# EAGLE design TeensyBufferWithNetworks (EAGLE 6.6.0)
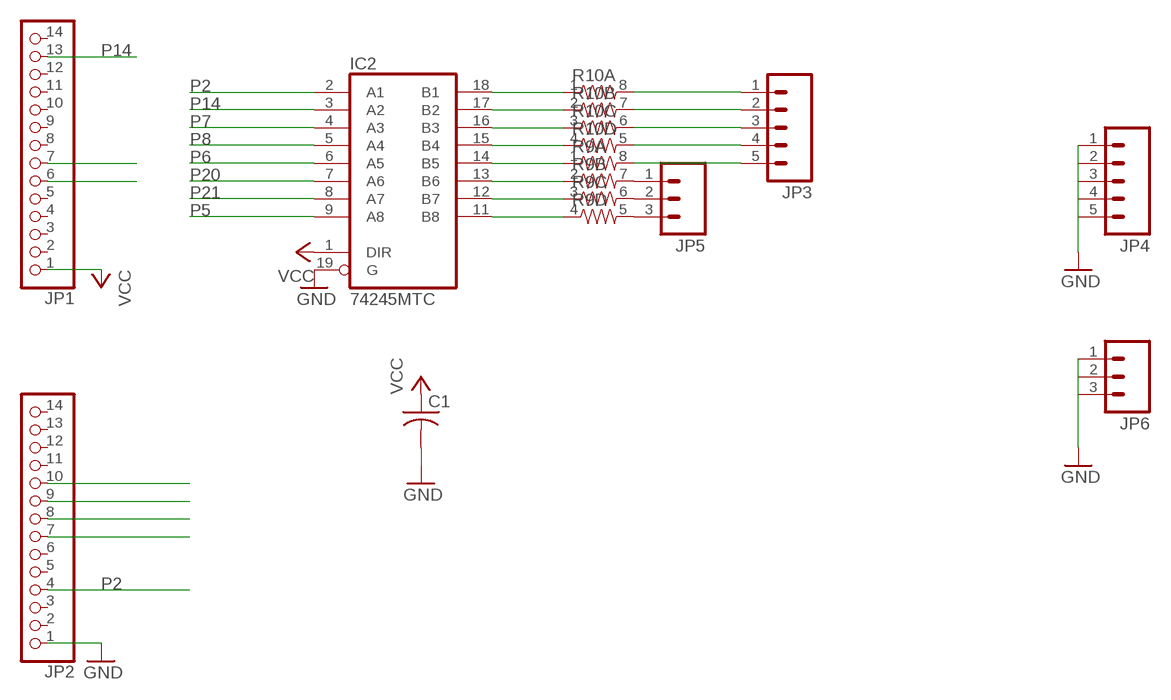
[diagram p0: schematic, sheet 1]

## Parts
C1  C-USC0805  [C0805]
IC2  74245MTC  [SSOP20]
JP1  PINHD-1X14-CB  [1X14-CB]
JP2  PINHD-1X14-CB  [1X14-CB]
JP3  M05NO_SILK  [1X05_NO_SILK]
JP4  M05NO_SILK  [1X05_NO_SILK]
JP5  M031X03_NO_SILK  [1X03_NO_SILK]
JP6  M031X03_NO_SILK  [1X03_NO_SILK]
R9  RESISTOR-ARRAY0603-ARV  [0603-ARV]
R10  RESISTOR-ARRAY0603-ARV  [0603-ARV]

## Nets
GND: C1.2 IC2.19(G) JP2.1 JP4.1 JP4.2 JP4.3 JP4.4 JP4.5 JP6.1 JP6.2 JP6.3
N$1: JP5.1 R9.7
N$2: JP5.2 R9.6
N$3: IC2.18(B1) R10.1
N$4: IC2.17(B2) R10.2
N$5: IC2.16(B3) R10.3
N$6: IC2.15(B4) R10.4
N$7: IC2.14(B5) R9.1
N$8: IC2.13(B6) R9.2
N$9: IC2.12(B7) R9.3
N$10: IC2.11(B8) R9.4
N$11: JP5.3 R9.5
N$12: JP3.1 R10.8
N$13: JP3.2 R10.7
N$14: JP3.3 R10.6
N$15: JP3.4 R10.5
N$16: JP3.5 R9.8
P2: IC2.2(A1) JP2.4
P5: IC2.9(A8) JP2.7
P6: IC2.6(A5) JP2.8
P7: IC2.4(A3) JP2.9
P8: IC2.5(A4) JP2.10
P14: IC2.3(A2) JP1.13
P20: IC2.7(A6) JP1.7
P21: IC2.8(A7) JP1.6
VCC: C1.1 IC2.1(DIR) JP1.1
Unconnected: JP1.2 JP1.3 JP1.4 JP1.5 JP1.8 JP1.9 JP1.10 JP1.11 JP1.12 JP1.14 JP2.2 JP2.3 JP2.5 JP2.6 JP2.11 JP2.12 JP2.13 JP2.14

## Power pins joined to a net without a drawn wire
GND: IC2.10(GND)
VCC: IC2.20(VCC)

## Library data of the parts
C1 = adafruit:C-US: CAPACITOR, American symbol
IC2 = adafruit:74*245: Octal BUS TRANSCEIVER, 3-state
JP1 JP2 = adafruit:PINHD-1X14: PIN HEADER
JP3 JP4 = SparkFun-Connectors:M05: Header 5 Standard 5-pin 0.1" header. Use with straight break away headers (SKU : PRT-00116), right angle break away headers (PRT-00553), swiss pins (PRT-00743), machine pins (PRT-00117), and female headers (PRT-00115). Molex polarized connector foot print use with SKU : PRT-08230 with associated crimp pins and housings.
JP5 JP6 = SparkFun-Connectors:M03: Header 3 Standard 3-pin 0.1" header. Use with straight break away headers (SKU : PRT-00116), right angle break away headers (PRT-00553), swiss pins (PRT-00743), machine pins (PRT-00117), and female headers (PRT-00115). Molex polarized connector foot print use with SKU : PRT-08232 with associated crimp pins and housings.
R9 R10 = SparkFun-Passives:RESISTOR-ARRAY: Array Chip Resistor Source: RS Component / Phycomp

## Board
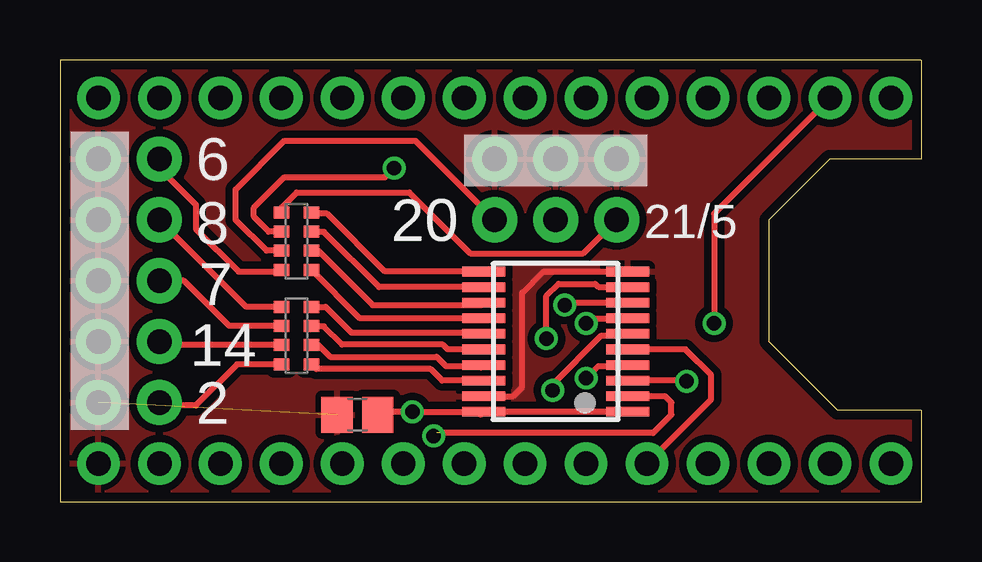
[diagram p1: board, top side]
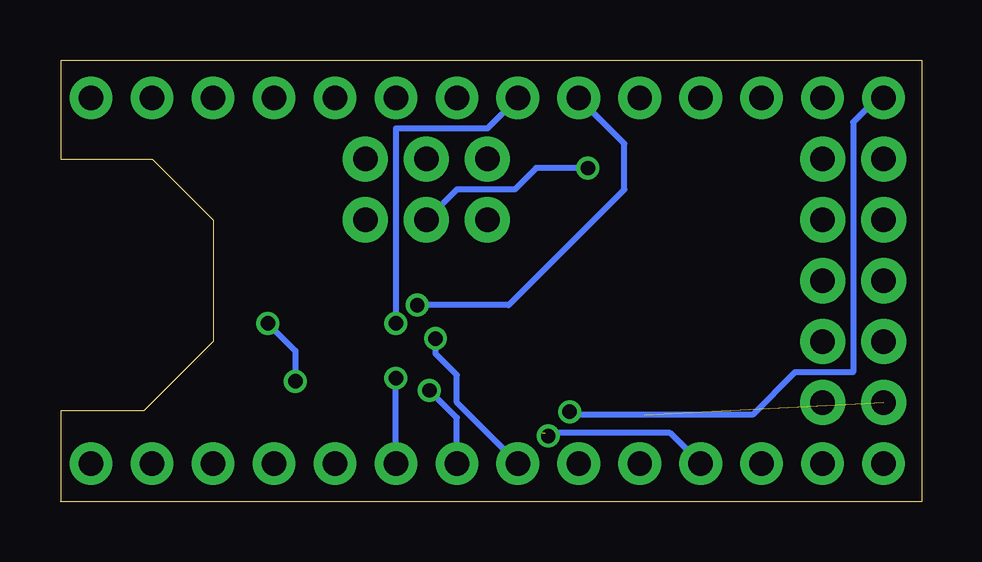
[diagram p2: board, bottom side, seen from below]

Size 35.92 x 18.43 mm. Coordinates in mm from the lower left corner, seen from the top.
Outline: 35.87,18.42 0.01,18.42
Outline: 35.89,18.43 35.89,14.3 32.08,14.3 29.54,11.76 29.54,6.68 32.4,3.82 35.89,3.82 35.89,0.01
Outline: 0,18.42 0,0 35.92,0
Copper layers (1*16): Top 0.0356mm / dielectric 1.5011mm / Bottom 0.0356mm
Design rules "OSHPark_Standard": minimum track width 6mil, minimum drill 13mil, track to track 6mil, track to pad 6mil, pad to pad 6mil, via to via 6mil, smd to smd 6mil, copper to edge 15mil, drill to drill 6mil, minimum pad ring 7mil, minimum via ring 7mil, stop-mask expansion 3mil, vias tented up to drill 0mil, thermal gap 10mil

### Footprints (pad centres in the part's own frame; a part is rotated, then mirrored left to right if it is on the bottom)
C0805 = smd 1.3 x 1.5: 1 -0.85,0; 2 0.85,0
SSOP20 = smd 0.4 x 1.8: 1 -2.925,-3; 2 -2.275,-3; 3 -1.625,-3; 4 -0.975,-3; 5 -0.325,-3; 6 0.325,-3; 7 0.975,-3; 8 1.625,-3; 9 2.275,-3; 10 2.925,-3; 11 2.925,3; 12 2.275,3; 13 1.625,3; 14 0.975,3; 15 0.325,3; 16 -0.325,3; 17 -0.975,3; 18 -1.625,3; 19 -2.275,3; 20 -2.925,3
1X14-CB = drill 1.016 pad 1.778: 1 -16.51,0; 2 -13.97,0; 3 -11.43,0; 4 -8.89,0; 5 -6.35,0; 6 -3.81,0; 7 -1.27,0; 8 1.27,0; 9 3.81,0; 10 6.35,0; 11 8.89,0; 12 11.43,0; 13 13.97,0; 14 16.51,0
1X05_NO_SILK = drill 1.016 pad 1.88: 1 0,0; 2 2.54,0; 3 5.08,0; 4 7.62,0; 5 10.16,0
1X03_NO_SILK = drill 1.016 pad 1.88: 1 0,0; 2 2.54,0; 3 5.08,0
0603-ARV = smd 0.5 x 0.65: 1 -1.2,-0.625; 2 -0.4,-0.625; 3 0.4,-0.625; 4 1.2,-0.625; 5 1.2,0.625; 6 0.4,0.625; 7 -0.4,0.625; 8 -1.2,0.625

### Placement (x,y rotation side)
C1  12.4,3.63 180 top
IC2  20.65,6.68 90 top
JP1  18.11,16.84 0 top
JP2  18.11,1.6 0 top
JP3  4.14,4.14 90 top
JP4  1.6,14.3 270 top
JP5  18.11,11.76 0 top
JP6  18.11,14.3 0 top
R9  9.86,10.87 90 top
R10  9.86,6.93 90 top

### Tracks (layer width: path | path; a pad name or v marks a point on that pad's centre or on a via)
GND  (1 unrouted)
  Top 0.254: IC2.19 18.88,4.41 19.25,4.78 19.25,8.71 20.14,9.6 IC2.10
  pour Top (isolate 0.305): -0.94,20.65 39.7,20.65 39.7,-2.21 -0.94,-2.21
N$1
  Top 0.254: R9.7 8.6,10.47 7.32,11.76 7.32,13.03 9.35,15.06 14.81,15.06 JP5.1
N$2  (via drill 0.6)
  Top 0.254: R9.6 8.69,11.27 8.08,11.89 8.08,12.27 9.35,13.54 13.54,13.54 v13.92,13.92
  Bottom 0.254: v13.92,13.92 16.08,13.92 16.97,13.03 19.38,13.03 JP5.2
N$3
  Top 0.254: IC2.18 15.93,5.06 15.44,5.54 10.68,5.54 R10.1
N$4
  Top 0.254: 17.55,5.6 IC2.17 17.61,5.66 16.08,5.66 15.7,6.05 11.25,6.05 10.76,6.53 R10.2
N$5
  Top 0.254: IC2.16 16.15,6.36 15.95,6.55 11.76,6.55 11,7.32 10.5,7.32 R10.3
N$6
  Top 0.254: R10.4 11.07,8.13 12.14,7.06 17.59,7.06 IC2.15
N$7
  Top 0.254: IC2.14 12.5,7.66 R9.1
N$8
  Top 0.254: R9.2 10.76,10.47 13.03,8.2 17.55,8.2 IC2.13
N$9
  Top 0.254: IC2.12 13.3,8.96 11,11.25 10.5,11.25 R9.3
N$10
  Top 0.254: IC2.11 13.53,9.61 11.13,12.01 10.54,12.01 R9.4
N$11
  Top 0.254: R9.5 9.23,12.28 9.86,12.9 14.55,12.9 17.09,10.36 21.79,10.36 JP5.3
N$12
  Top 0.254: R10.8 7.39,5.73 5.66,4.01 4.27,4.01 JP3.1
N$13
  Top 0.254: R10.7 4.29,6.53 JP3.2
N$14
  Top 0.254: R10.6 7.04,7.33 5.16,9.22 JP3.3
N$15
  Top 0.254: R10.5 7.77,8.13 JP3.4
N$16
  Top 0.254: JP3.5 4.14,13.92 5.66,12.4 5.66,11.38 7.44,9.6 9.16,9.6 R9.8
P2  (via drill 0.6)  (1 unrouted)
  Top 0.254: IC2.2 25.21,4.41 25.48,4.14 25.48,3.63 24.71,2.87 15.7,2.87 v15.57,2.74
  Bottom 0.254: JP2.4 10.49,2.87 15.82,2.87
P5  (via drill 0.6)
  Top 0.254: IC2.9 23.64,8.97 22.43,8.97 22.3,9.09 20.78,9.09 20.27,8.59 v20.27,6.81
  Bottom 0.254: JP2.7 19.38,4.14 19.38,5.28 20.27,6.17 v20.27,6.81
P6  (via drill 0.6)
  Top 0.254: v20.52,4.65 20.52,4.9 22.56,6.93 23.58,6.93 IC2.6
  Bottom 0.254: JP2.8 19.38,3.51 v20.52,4.65
P7  (via drill 0.6)
  Top 0.254: 21.79,5.03 v21.92,5.16 22.43,5.66 23.61,5.66 IC2.4
  Bottom 0.254: JP2.9 v21.92,5.16
P8
  Top 0.254: JP2.10 27.13,4.27 27.13,5.28 26.06,6.36 IC2.5
P14  (via drill 0.6)
  Top 0.254: JP1.13 27.25,12.01 v27.25,7.44 | v26.11,5.03 26.09,5.06 IC2.3
  Bottom 0.254: v27.25,7.44 26.11,6.3 v26.11,5.03
P20  (via drill 0.6)
  Top 0.254: v21.92,7.44 22.13,7.66 IC2.7
  Bottom 0.254: JP1.7 18.11,15.57 21.92,15.57 v21.92,7.44
P21  (via drill 0.6)
  Top 0.254: v21.03,8.2 21.13,8.31 IC2.8
  Bottom 0.254: v21.03,8.2 17.22,8.2 12.4,13.03 12.4,14.94 JP1.6
VCC  (via drill 0.6)
  Top 0.254: IC2.1 IC2.20 | 17.53,3.63 IC2.20 | C1.1 13.37,3.76 v14.68,3.76 IC2.20
  Bottom 0.254: JP1.1 1.85,16.84 2.87,15.82 2.87,5.41 5.28,5.41 7.06,3.63 14.55,3.63 v14.68,3.76

### Text on the board
tPlace: 6 | 8 | 20 | 21/5 | 7 | 14 | 2